# EasyEDA Pro project STM32F103RCT6_编码器电机驱动部分.eprj

# Schematic Schematic1
Board Name: Board1; Create Date: 2026-04-15; Page Name: P1; Project Name: STM32F103RCT6_编码器电机驱动部分; Schematic Name: Schematic1; Update Date: 2026-04-15; Company: 嘉立创EDA; Page Size: A4; Version: V1.0
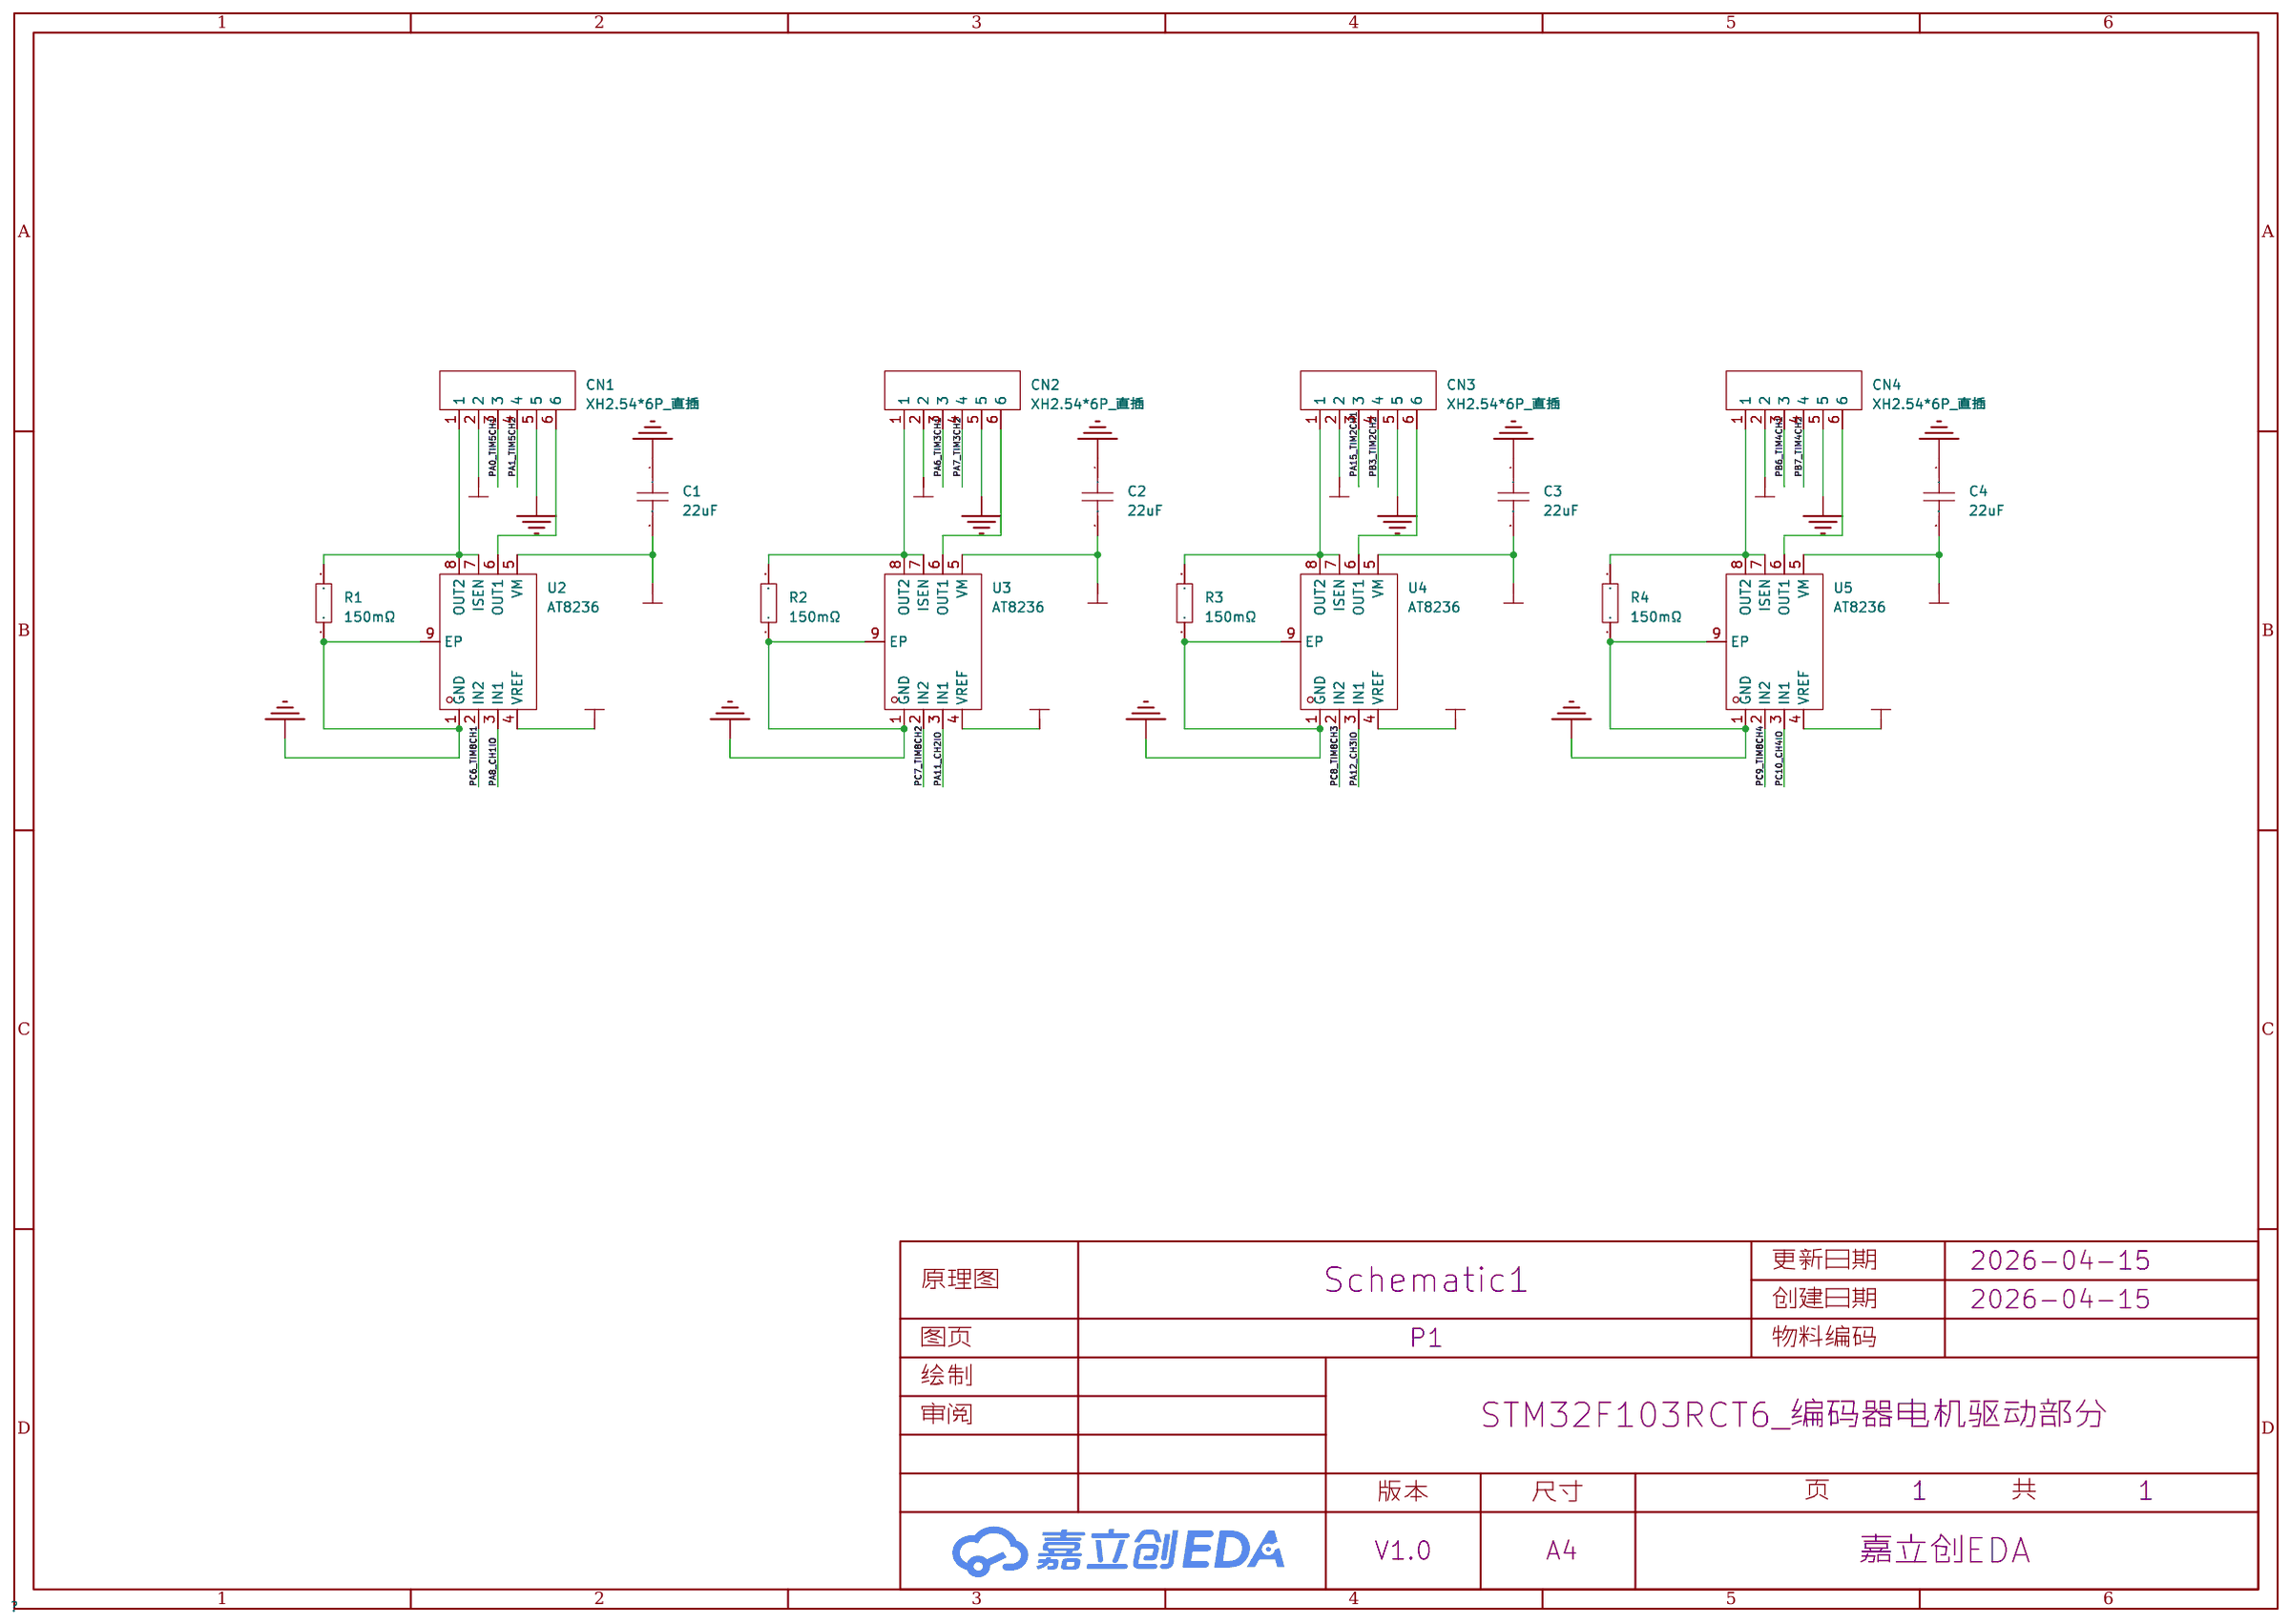
[diagram p0: schematic sheet]

## Parts
C1  22uF  [C0603]
C2  22uF  [C0603]
C3  22uF  [C0603]
C4  22uF  [C0603]
CN1  XH2.54*6P_直插  [CONN-TH_XH2.54-6P]
CN2  XH2.54*6P_直插  [CONN-TH_XH2.54-6P]
CN3  XH2.54*6P_直插  [CONN-TH_XH2.54-6P]
CN4  XH2.54*6P_直插  [CONN-TH_XH2.54-6P]
R1  150mΩ  [R0603]
R2  150mΩ  [R0603]
R3  150mΩ  [R0603]
R4  150mΩ  [R0603]
U2  AT8236  [ESOP-8_L4.9-W3.9-P1.27-LS6.0-BL-EP]
U3  AT8236  [ESOP-8_L4.9-W3.9-P1.27-LS6.0-BL-EP]
U4  AT8236  [ESOP-8_L4.9-W3.9-P1.27-LS6.0-BL-EP]
U5  AT8236  [ESOP-8_L4.9-W3.9-P1.27-LS6.0-BL-EP]

## Library data of the parts
C1-C4 = CAP_0603: Supplier Footprint: 0603
CN1-CN4 = XH2.54*6P_直插: Supplier Part: C9900008614; Supplier Footprint: XH2.54_6P; JLCPCB Part Class: 扩展库; Supplier: LCSC
R1-R4 = Res_0603: Supplier Footprint: 0603
U2-U5 = AT8236: LCSC Part Name: 单通道直流有刷电机驱动芯片; Supplier Part: C2827823; Manufacturer: 杭州中科微; Supplier Footprint: ESOP-8; JLCPCB Part Class: 扩展库; Datasheet: https://item.szlcsc.com/datasheet/AT8236/2974744.html; Supplier: LCSC; Number of H-bridges: 1; Output Current: 3A; Peak Current: 6A; RDS(on): 200mΩ; Quiescent Current(Iq): 20uA; Operating Temperature: -40℃~+85℃

## Nets
+3V3: U2.4(VREF) U3.4(VREF) U4.4(VREF) U5.4(VREF)
GND: CN1.5 CN2.5 CN3.5 CN4.5
PGND: C1.1 C2.1 C3.1 C4.1 R1.1 R2.1 R3.1 R4.1 U2.1(GND) U2.9(EP) U3.1(GND) U3.9(EP) U4.1(GND) U4.9(EP) U5.1(GND) U5.9(EP)
VCC_5V: CN1.2 CN2.2 CN3.2 CN4.2
VIN: C1.2 C2.2 C3.2 C4.2 U2.5(VM) U3.5(VM) U4.5(VM) U5.5(VM)
PA0_TIM5CH1: CN1.3
PA1_TIM5CH2: CN1.4
PA6_TIM3CH1: CN2.3
PA7_TIM3CH2: CN2.4
PA8_CH1IO: U2.3(IN1)
PA11_CH2IO: U3.3(IN1)
PA12_CH3IO: U4.3(IN1)
PA15_TIM2CH1: CN3.3
PB3_TIM2CH2: CN3.4
PB6_TIM4CH1: CN4.3
PB7_TIM4CH2: CN4.4
PC6_TIM8CH1: U2.2(IN2)
PC7_TIM8CH2: U3.2(IN2)
PC8_TIM8CH3: U4.2(IN2)
PC9_TIM8CH4: U5.2(IN2)
PC10_CH4IO: U5.3(IN1)
Net-(CN1-1): CN1.1 R1.2 U2.7(ISEN) U2.8(OUT2)
Net-(CN1-6): CN1.6 U2.6(OUT1)
Net-(CN2-1): CN2.1 R2.2 U3.7(ISEN) U3.8(OUT2)
Net-(CN2-6): CN2.6 U3.6(OUT1)
Net-(CN3-1): CN3.1 R3.2 U4.7(ISEN) U4.8(OUT2)
Net-(CN3-6): CN3.6 U4.6(OUT1)
Net-(CN4-1): CN4.1 R4.2 U5.7(ISEN) U5.8(OUT2)
Net-(CN4-6): CN4.6 U5.6(OUT1)
